# EAGLE board 10m02 (EAGLE 6.5.0)
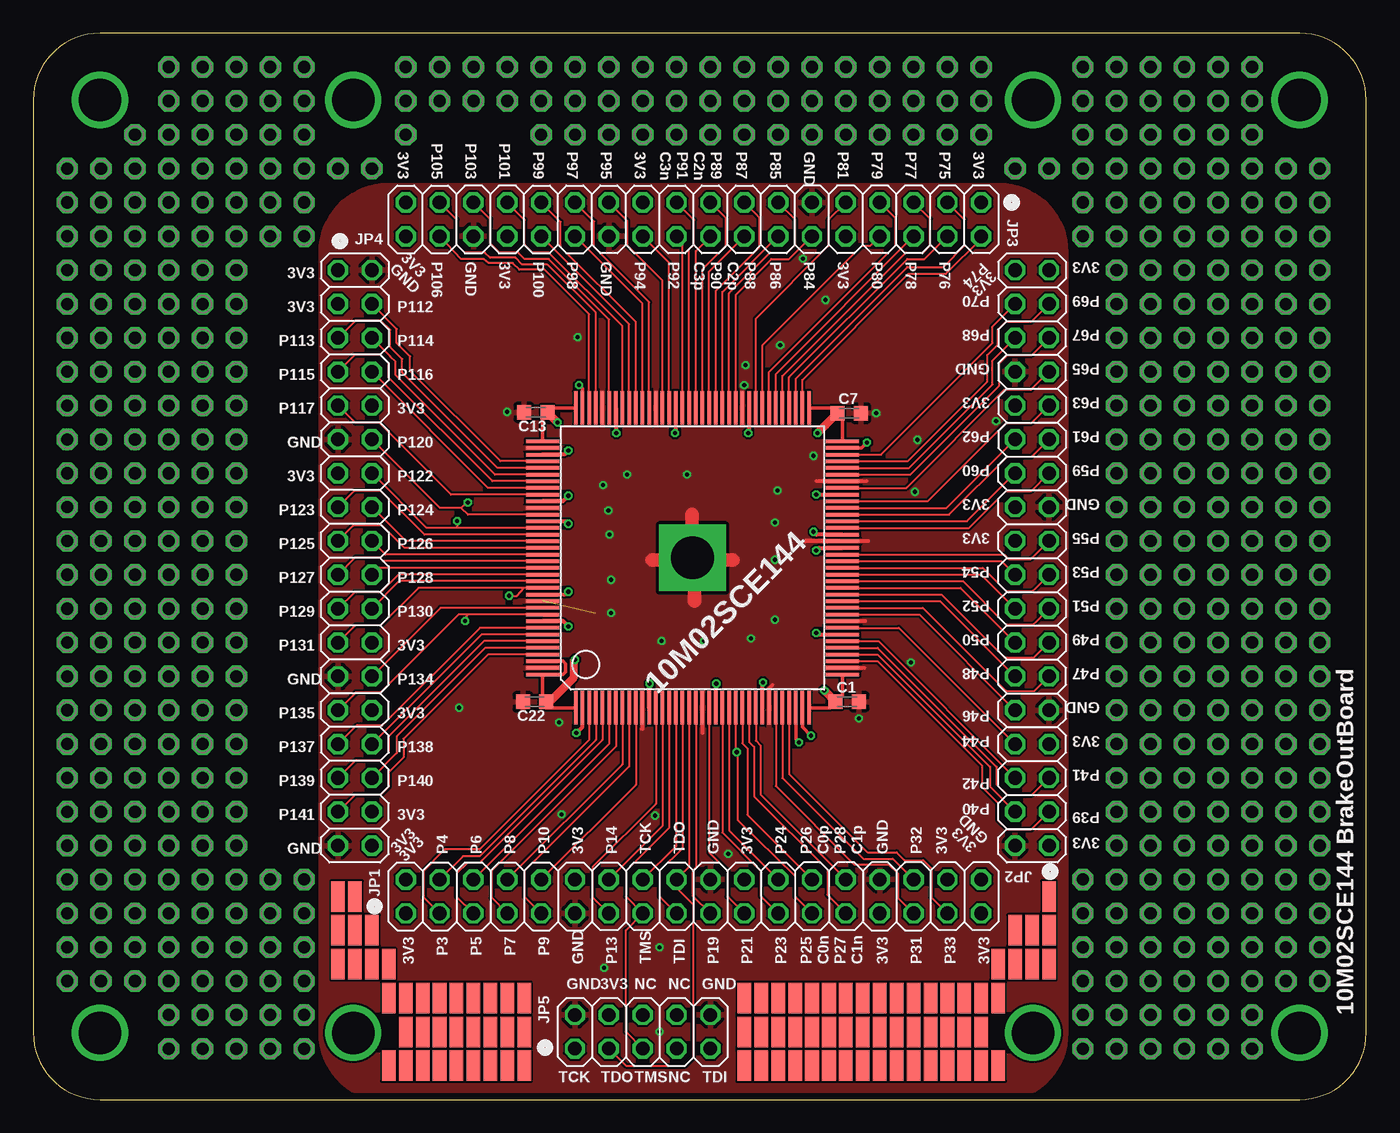
[diagram p1: board, top side]
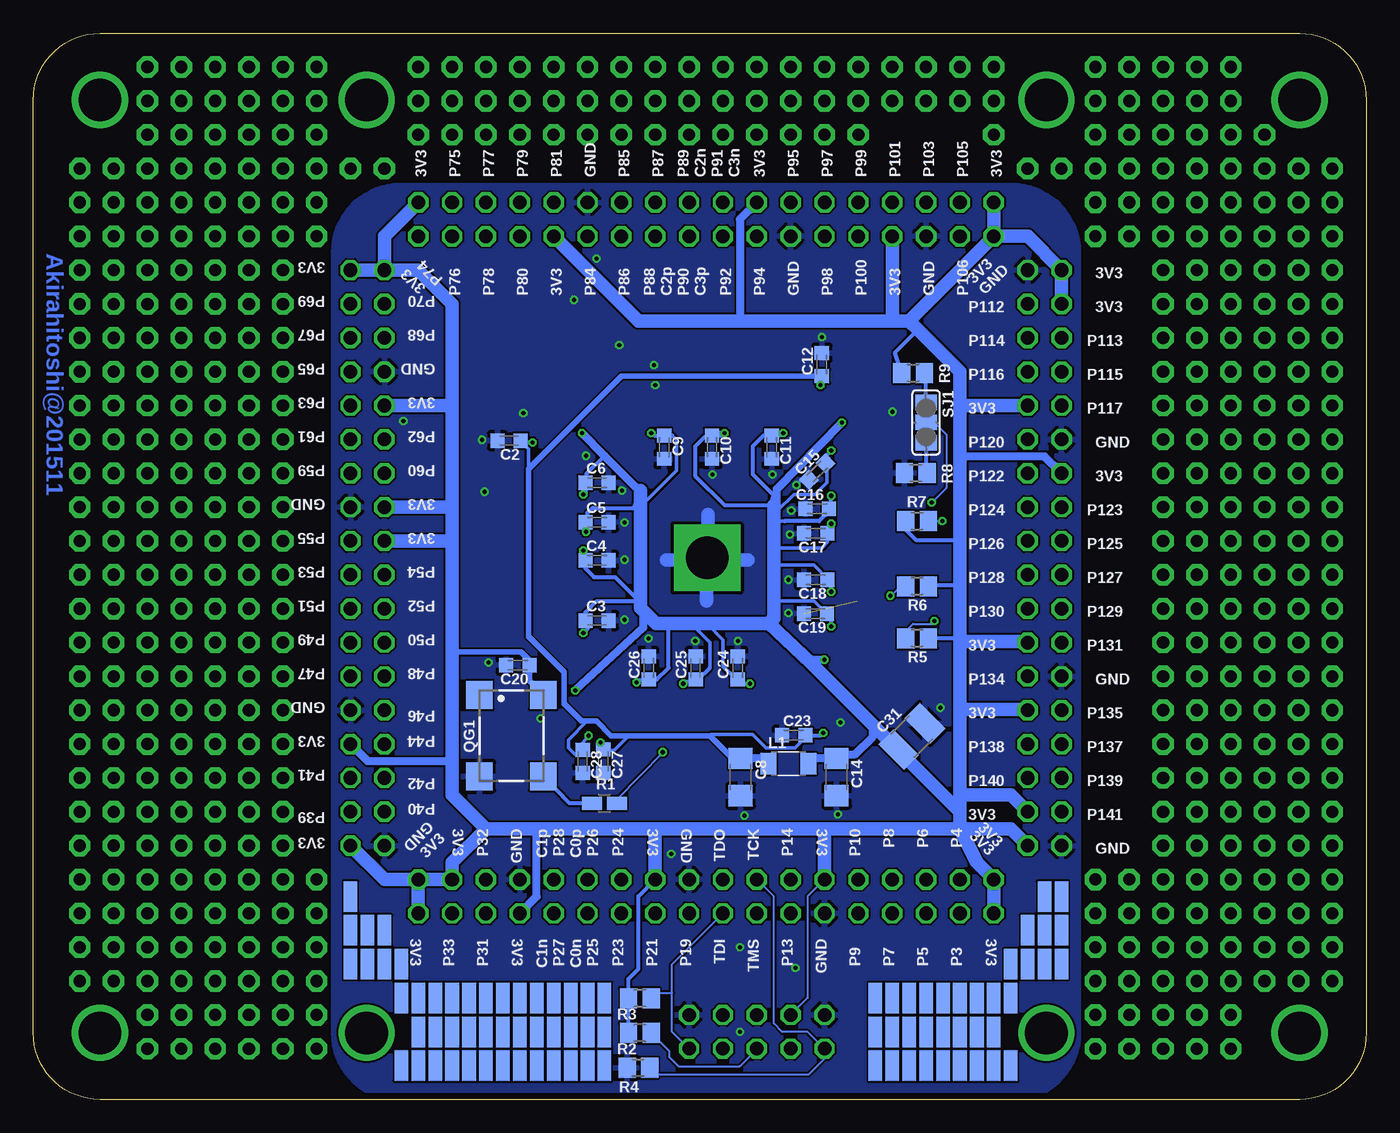
[diagram p2: board, bottom side, seen from below]

Size 100 x 80 mm. Coordinates in mm from the lower left corner, seen from the top.
Outline: 95,80 5,80 arc90 0,75 0,5 arc90 5,0 95,0 arc90 100,5 100,75 arc90 95,80
Copper layers (1*16): Top 0.035mm / dielectric 1.6mm / Bottom 0.035mm
Design rules "Elecrow_2-layer_PCB_eagle_rule": minimum track width 6mil, minimum drill 12mil, track to track 6mil, track to pad 6mil, pad to pad 6mil, via to via 8mil, smd to smd 0mil, copper to edge 20mil, drill to drill 10mil, minimum pad ring 6mil, minimum via ring 6mil, stop-mask expansion 0mil, vias tented up to drill 100mil, thermal gap 10mil

## Footprints (pad centres in the part's own frame; a part is rotated, then mirrored left to right if it is on the bottom)
C0603K = smd 1.05 x 1.08: 1 -0.875,0; 2 0.875,0
C3216 = smd 1.6 x 1.8: 1 -1.4,0; 2 1.4,0
C3225 = smd 1.6 x 2.7: 1 -1.4,0; 2 1.4,0
TQFP144G = smd 2.5 x 0.27: 1 -11.25,8.83; 2 -11.25,8.33; 3 -11.25,7.83; 4 -11.25,7.33; 5 -11.25,6.83; 6 -11.25,6.33; 7 -11.25,5.83; 8 -11.25,5.33; 9 -11.25,4.83; 10 -11.25,4.33; 11 -11.25,3.83; 12 -11.25,3.33; 13 -11.25,2.83; 14 -11.25,2.33; 15 -11.25,1.83; 16 -11.25,1.33; 17 -11.25,0.83; 18 -11.25,0.33; 19 -11.25,-0.17; 20 -11.25,-0.67; 21 -11.25,-1.17; 22 -11.25,-1.67; 23 -11.25,-2.17; 24 -11.25,-2.67; 25 -11.25,-3.17; 26 -11.25,-3.67; 27 -11.25,-4.17; 28 -11.25,-4.67; 29 -11.25,-5.17; 30 -11.25,-5.67; 31 -11.25,-6.17; 32 -11.25,-6.67; 33 -11.25,-7.17; 34 -11.25,-7.67; 35 -11.25,-8.17; 36 -11.25,-8.67; 73 11.25,-8.67; 74 11.25,-8.17; 75 11.25,-7.67; 76 11.25,-7.17; 77 11.25,-6.67; 78 11.25,-6.17; 79 11.25,-5.67; 80 11.25,-5.17; 81 11.25,-4.67; 82 11.25,-4.17; 83 11.25,-3.67; 84 11.25,-3.17; 85 11.25,-2.67; 86 11.25,-2.17; 87 11.25,-1.67; 88 11.25,-1.17; 89 11.25,-0.67; 90 11.25,-0.17; 91 11.25,0.33; 92 11.25,0.83; 93 11.25,1.33; 94 11.25,1.83; 95 11.25,2.33; 96 11.25,2.83; 97 11.25,3.33; 98 11.25,3.83; 99 11.25,4.33; 100 11.25,4.83; 101 11.25,5.33; 102 11.25,5.83; 103 11.25,6.33; 104 11.25,6.83; 105 11.25,7.33; 106 11.25,7.83; 107 11.25,8.33; 108 11.25,8.83 | smd 0.27 x 2.5: 37 -8.75,-11.17; 38 -8.25,-11.17; 39 -7.75,-11.17; 40 -7.25,-11.17; 41 -6.75,-11.17; 42 -6.25,-11.17; 43 -5.75,-11.17; 44 -5.25,-11.17; 45 -4.75,-11.17; 46 -4.25,-11.17; 47 -3.75,-11.17; 48 -3.25,-11.17; 49 -2.75,-11.17; 50 -2.25,-11.17; 51 -1.75,-11.17; 52 -1.25,-11.17; 53 -0.75,-11.17; 54 -0.25,-11.17; 55 0.25,-11.17; 56 0.75,-11.17; 57 1.25,-11.17; 58 1.75,-11.17; 59 2.25,-11.17; 60 2.75,-11.17; 61 3.25,-11.17; 62 3.75,-11.17; 63 4.25,-11.17; 64 4.75,-11.17; 65 5.25,-11.17; 66 5.75,-11.17; 67 6.25,-11.17; 68 6.75,-11.17; 69 7.25,-11.17; 70 7.75,-11.17; 71 8.25,-11.17; 72 8.75,-11.17; 109 8.75,11.33; 110 8.25,11.33; 111 7.75,11.33; 112 7.25,11.33; 113 6.75,11.33; 114 6.25,11.33; 115 5.75,11.33; 116 5.25,11.33; 117 4.75,11.33; 118 4.25,11.33; 119 3.75,11.33; 120 3.25,11.33; 121 2.75,11.33; 122 2.25,11.33; 123 1.75,11.33; 124 1.25,11.33; 125 0.75,11.33; 126 0.25,11.33; 127 -0.25,11.33; 128 -0.75,11.33; 129 -1.25,11.33; 130 -1.75,11.33; 131 -2.25,11.33; 132 -2.75,11.33; 133 -3.25,11.33; 134 -3.75,11.33; 135 -4.25,11.33; 136 -4.75,11.33; 137 -5.25,11.33; 138 -5.75,11.33; 139 -6.25,11.33; 140 -6.75,11.33; 141 -7.25,11.33; 142 -7.75,11.33; 143 -8.25,11.33; 144 -8.75,11.33 | drill 3.2 pad 5 square: 145 0,0.08
2X18 = drill 1.016 octagon: 1 -21.59,-1.27; 2 -21.59,1.27; 3 -19.05,-1.27; 4 -19.05,1.27; 5 -16.51,-1.27; 6 -16.51,1.27; 7 -13.97,-1.27; 8 -13.97,1.27; 9 -11.43,-1.27; 10 -11.43,1.27; 11 -8.89,-1.27; 12 -8.89,1.27; 13 -6.35,-1.27; 14 -6.35,1.27; 15 -3.81,-1.27; 16 -3.81,1.27; 17 -1.27,-1.27; 18 -1.27,1.27; 19 1.27,-1.27; 20 1.27,1.27; 21 3.81,-1.27; 22 3.81,1.27; 23 6.35,-1.27; 24 6.35,1.27; 25 8.89,-1.27; 26 8.89,1.27; 27 11.43,-1.27; 28 11.43,1.27; 29 13.97,-1.27; 30 13.97,1.27; 31 16.51,-1.27; 32 16.51,1.27; 33 19.05,-1.27; 34 19.05,1.27; 35 21.59,-1.27; 36 21.59,1.27
2X05 = drill 1.016 octagon: 1 -5.08,-1.27; 2 -5.08,1.27; 3 -2.54,-1.27; 4 -2.54,1.27; 5 0,-1.27; 6 0,1.27; 7 2.54,-1.27; 8 2.54,1.27; 9 5.08,-1.27; 10 5.08,1.27
L3216C = smd 1.2 x 1.6: 1 -1.5,0; 2 1.5,0
1,6/0,9 = drill 0.914 pad 1.6 octagon: 1 0,0
SMD1,27-2,54 = smd 1.02 x 2.29: 1 0,0
SM77HL = smd 2.1 x 2: 1 -3.05,-2.4; 2 3.05,-2.4; 3 3.05,2.4; 4 -3.05,2.4
R2012W = smd 1.5 x 1: 1 -0.94,0; 2 0.94,0
R2012 = smd 1.3 x 1.5: 1 -0.85,0; 2 0.85,0
SJ_2 = smd 1.168 x 1.6: 1 -1.524,0; 2 0,0; 3 1.524,0

## Placement (x,y rotation side)
C1  0.1u  [C0603K]  61.07,29.85 0 top
C2  0.1u  [C0603K]  64.31,49.44 180 bottom
C3  0.1u  [C0603K]  57.71,35.94 0 bottom
C4  0.1u  [C0603K]  57.71,40.46 0 bottom
C5  0.1u  [C0603K]  57.71,43.32 0 bottom
C6  0.1u  [C0603K]  57.71,46.28 0 bottom
C7  0.1u  [C0603K]  61.21,51.5 0 top
C8  [C3216]  46.94,24.2 270 bottom
C9  0.1u  [C0603K]  52.67,48.95 270 bottom
C10  0.1u  [C0603K]  49.08,48.95 270 bottom
C11  0.1u  [C0603K]  44.59,48.95 270 bottom
C12  0.1u  [C0603K]  40.84,55.15 90 bottom
C13  0.1u  [C0603K]  37.69,51.56 180 top
C14  [C3216]  39.74,24.2 270 bottom
C15  0.1u  [C0603K]  41.19,47.12 225 bottom
C16  0.1u  [C0603K]  41.19,44.32 180 bottom
C17  0.1u  [C0603K]  41.29,42.48 180 bottom
C18  0.1u  [C0603K]  41.29,39 180 bottom
C19  0.1u  [C0603K]  41.32,36.46 180 bottom
C20  0.1u  [C0603K]  63.66,32.59 180 bottom
C22  0.1u  [C0603K]  37.61,29.84 180 top
C23  0.1u  [C0603K]  42.94,27.33 0 bottom
C24  0.1u  [C0603K]  47.16,32.38 90 bottom
C25  0.1u  [C0603K]  50.31,32.38 90 bottom
C26  0.1u  [C0603K]  53.84,32.38 90 bottom
C27  0.1u  [C0603K]  57.23,25.38 270 bottom
C28  0.1u  [C0603K]  58.79,25.37 270 bottom
C31  [C3225]  34.1,27.23 45 bottom
IC1  10M02SC144  [TQFP144G]  49.53,40.64 90 top
JP1  [2X18]  49.53,15.24 0 top
JP2  [2X18]  74.93,40.64 90 top
JP3  [2X18]  49.53,66.04 180 top
JP4  [2X18]  24.13,40.64 270 top
JP5  [2X05]  45.72,5.08 0 top
L1  [L3216C]  43.34,25.2 0 bottom
PAD1  [1,6/0,9]  81.28,3.81 0 top
PAD2  [1,6/0,9]  10.16,3.81 0 top
PAD3  [1,6/0,9]  10.16,6.35 0 top
PAD4  [1,6/0,9]  20.32,8.89 0 top
PAD5  [1,6/0,9]  20.32,11.43 0 top
PAD6  [1,6/0,9]  20.32,13.97 0 top
PAD7  [1,6/0,9]  20.32,16.51 0 top
PAD8  [1,6/0,9]  17.78,16.51 0 top
PAD9  [1,6/0,9]  17.78,13.97 0 top
PAD10  [1,6/0,9]  5.08,69.85 0 top
PAD11  [1,6/0,9]  5.08,67.31 0 top
PAD12  [1,6/0,9]  2.54,69.85 90 top
PAD13  [1,6/0,9]  2.54,67.31 90 top
PAD14  [1,6/0,9]  2.54,64.77 90 top
PAD15  [1,6/0,9]  2.54,62.23 90 top
PAD16  [1,6/0,9]  2.54,59.69 90 top
PAD17  [1,6/0,9]  2.54,57.15 90 top
PAD18  [1,6/0,9]  2.54,54.61 90 top
PAD19  [1,6/0,9]  2.54,52.07 0 top
PAD20  [1,6/0,9]  15.24,19.05 0 top
PAD21  [1,6/0,9]  12.7,19.05 0 top
PAD22  [1,6/0,9]  10.16,19.05 0 top
PAD23  [1,6/0,9]  7.62,19.05 0 top
PAD24  [1,6/0,9]  5.08,19.05 0 top
PAD25  [1,6/0,9]  2.54,19.05 0 top
PAD26  [1,6/0,9]  17.78,11.43 0 top
PAD27  [1,6/0,9]  88.9,57.15 0 top
PAD28  [1,6/0,9]  86.36,57.15 0 top
PAD29  [1,6/0,9]  83.82,57.15 0 top
PAD30  [1,6/0,9]  81.28,57.15 0 top
PAD31  [1,6/0,9]  81.28,54.61 0 top
PAD32  [1,6/0,9]  83.82,54.61 0 top
PAD33  [1,6/0,9]  86.36,54.61 0 top
PAD34  [1,6/0,9]  88.9,54.61 0 top
PAD35  [1,6/0,9]  17.78,8.89 270 top
PAD36  [1,6/0,9]  81.28,52.07 0 top
PAD37  [1,6/0,9]  83.82,52.07 0 top
PAD38  [1,6/0,9]  86.36,52.07 0 top
PAD39  [1,6/0,9]  88.9,52.07 0 top
PAD40  [1,6/0,9]  15.24,8.89 270 top
PAD41  [1,6/0,9]  81.28,49.53 0 top
PAD42  [1,6/0,9]  83.82,49.53 0 top
PAD43  [1,6/0,9]  86.36,49.53 0 top
PAD44  [1,6/0,9]  88.9,49.53 0 top
PAD45  [1,6/0,9]  12.7,8.89 270 top
PAD46  [1,6/0,9]  81.28,46.99 0 top
PAD47  [1,6/0,9]  83.82,46.99 0 top
PAD48  [1,6/0,9]  86.36,46.99 0 top
PAD49  [1,6/0,9]  88.9,46.99 0 top
PAD50  [1,6/0,9]  10.16,8.89 270 top
PAD51  [1,6/0,9]  81.28,44.45 0 top
PAD52  [1,6/0,9]  83.82,44.45 0 top
PAD53  [1,6/0,9]  86.36,44.45 0 top
PAD54  [1,6/0,9]  88.9,44.45 0 top
PAD55  [1,6/0,9]  7.62,8.89 270 top
PAD56  [1,6/0,9]  81.28,41.91 0 top
PAD57  [1,6/0,9]  83.82,41.91 0 top
PAD58  [1,6/0,9]  86.36,41.91 0 top
PAD59  [1,6/0,9]  88.9,41.91 0 top
PAD60  [1,6/0,9]  5.08,8.89 270 top
PAD61  [1,6/0,9]  81.28,39.37 0 top
PAD62  [1,6/0,9]  83.82,39.37 0 top
PAD63  [1,6/0,9]  86.36,39.37 0 top
PAD64  [1,6/0,9]  88.9,39.37 0 top
PAD65  [1,6/0,9]  2.54,8.89 270 top
PAD66  [1,6/0,9]  12.7,6.35 0 top
PAD67  [1,6/0,9]  15.24,6.35 0 top
PAD68  [1,6/0,9]  81.28,36.83 0 top
PAD69  [1,6/0,9]  83.82,36.83 0 top
PAD70  [1,6/0,9]  86.36,36.83 0 top
PAD71  [1,6/0,9]  88.9,36.83 0 top
PAD72  [1,6/0,9]  12.7,3.81 0 top
PAD73  [1,6/0,9]  83.82,3.81 0 top
PAD74  [1,6/0,9]  15.24,3.81 0 top
PAD75  [1,6/0,9]  81.28,34.29 0 top
PAD76  [1,6/0,9]  83.82,34.29 0 top
PAD77  [1,6/0,9]  86.36,34.29 0 top
PAD78  [1,6/0,9]  88.9,34.29 0 top
PAD79  [1,6/0,9]  15.24,16.51 270 top
PAD80  [1,6/0,9]  15.24,13.97 270 top
PAD81  [1,6/0,9]  15.24,11.43 270 top
PAD82  [1,6/0,9]  81.28,31.75 0 top
PAD83  [1,6/0,9]  83.82,31.75 0 top
PAD84  [1,6/0,9]  86.36,31.75 0 top
PAD85  [1,6/0,9]  88.9,31.75 0 top
PAD86  [1,6/0,9]  12.7,16.51 270 top
PAD87  [1,6/0,9]  12.7,13.97 270 top
PAD88  [1,6/0,9]  12.7,11.43 270 top
PAD89  [1,6/0,9]  81.28,29.21 0 top
PAD90  [1,6/0,9]  83.82,29.21 0 top
PAD91  [1,6/0,9]  86.36,29.21 0 top
PAD92  [1,6/0,9]  88.9,29.21 0 top
PAD93  [1,6/0,9]  10.16,16.51 270 top
PAD94  [1,6/0,9]  10.16,13.97 270 top
PAD95  [1,6/0,9]  10.16,11.43 270 top
PAD96  [1,6/0,9]  81.28,26.67 0 top
PAD97  [1,6/0,9]  83.82,26.67 0 top
PAD98  [1,6/0,9]  86.36,26.67 0 top
PAD99  [1,6/0,9]  88.9,26.67 0 top
PAD100  [1,6/0,9]  7.62,16.51 270 top
PAD101  [1,6/0,9]  7.62,13.97 270 top
PAD102  [1,6/0,9]  7.62,11.43 270 top
PAD103  [1,6/0,9]  81.28,24.13 0 top
PAD104  [1,6/0,9]  83.82,24.13 0 top
PAD105  [1,6/0,9]  86.36,24.13 0 top
PAD106  [1,6/0,9]  88.9,24.13 0 top
PAD107  [1,6/0,9]  5.08,16.51 270 top
PAD108  [1,6/0,9]  5.08,13.97 270 top
PAD109  [1,6/0,9]  5.08,11.43 270 top
PAD110  [1,6/0,9]  81.28,21.59 0 top
PAD111  [1,6/0,9]  83.82,21.59 0 top
PAD112  [1,6/0,9]  86.36,21.59 0 top
PAD113  [1,6/0,9]  88.9,21.59 0 top
PAD114  [1,6/0,9]  2.54,16.51 270 top
PAD115  [1,6/0,9]  2.54,13.97 270 top
PAD116  [1,6/0,9]  2.54,11.43 270 top
PAD117  [1,6/0,9]  81.28,19.05 0 top
PAD118  [1,6/0,9]  83.82,19.05 0 top
PAD119  [1,6/0,9]  86.36,19.05 0 top
PAD120  [1,6/0,9]  88.9,19.05 0 top
PAD121  [1,6/0,9]  2.54,49.53 0 top
PAD122  [1,6/0,9]  5.08,49.53 0 top
PAD123  [1,6/0,9]  7.62,49.53 0 top
PAD124  [1,6/0,9]  10.16,49.53 0 top
PAD125  [1,6/0,9]  12.7,49.53 0 top
PAD126  [1,6/0,9]  15.24,49.53 0 top
PAD127  [1,6/0,9]  5.08,52.07 0 top
PAD128  [1,6/0,9]  5.08,54.61 0 top
PAD129  [1,6/0,9]  5.08,57.15 0 top
PAD130  [1,6/0,9]  5.08,59.69 0 top
PAD131  [1,6/0,9]  2.54,46.99 0 top
PAD132  [1,6/0,9]  5.08,46.99 0 top
PAD133  [1,6/0,9]  7.62,46.99 0 top
PAD134  [1,6/0,9]  10.16,46.99 0 top
PAD135  [1,6/0,9]  12.7,46.99 0 top
PAD136  [1,6/0,9]  15.24,46.99 0 top
PAD137  [1,6/0,9]  5.08,62.23 0 top
PAD138  [1,6/0,9]  10.16,77.47 0 top
PAD139  [1,6/0,9]  12.7,77.47 0 top
PAD140  [1,6/0,9]  15.24,77.47 0 top
PAD141  [1,6/0,9]  2.54,44.45 0 top
PAD142  [1,6/0,9]  5.08,44.45 0 top
PAD143  [1,6/0,9]  7.62,44.45 0 top
PAD144  [1,6/0,9]  10.16,44.45 0 top
PAD145  [1,6/0,9]  12.7,44.45 0 top
PAD146  [1,6/0,9]  15.24,44.45 0 top
PAD147  [1,6/0,9]  5.08,64.77 0 top
PAD148  [1,6/0,9]  10.16,74.93 0 top
PAD149  [1,6/0,9]  12.7,74.93 0 top
PAD150  [1,6/0,9]  15.24,74.93 0 top
PAD151  [1,6/0,9]  2.54,41.91 0 top
PAD152  [1,6/0,9]  5.08,41.91 0 top
PAD153  [1,6/0,9]  7.62,41.91 0 top
PAD154  [1,6/0,9]  10.16,41.91 0 top
PAD155  [1,6/0,9]  12.7,41.91 0 top
PAD156  [1,6/0,9]  15.24,41.91 0 top
PAD157  [1,6/0,9]  7.62,72.39 0 top
PAD158  [1,6/0,9]  10.16,72.39 0 top
PAD159  [1,6/0,9]  12.7,72.39 0 top
PAD160  [1,6/0,9]  15.24,72.39 0 top
PAD161  [1,6/0,9]  2.54,39.37 0 top
PAD162  [1,6/0,9]  5.08,39.37 0 top
PAD163  [1,6/0,9]  7.62,39.37 0 top
PAD164  [1,6/0,9]  10.16,39.37 0 top
PAD165  [1,6/0,9]  12.7,39.37 0 top
PAD166  [1,6/0,9]  15.24,39.37 0 top
PAD167  [1,6/0,9]  7.62,69.85 0 top
PAD168  [1,6/0,9]  10.16,69.85 0 top
PAD169  [1,6/0,9]  12.7,69.85 0 top
PAD170  [1,6/0,9]  15.24,69.85 0 top
PAD171  [1,6/0,9]  2.54,36.83 0 top
PAD172  [1,6/0,9]  5.08,36.83 0 top
PAD173  [1,6/0,9]  7.62,36.83 0 top
PAD174  [1,6/0,9]  10.16,36.83 0 top
PAD175  [1,6/0,9]  12.7,36.83 0 top
PAD176  [1,6/0,9]  15.24,36.83 0 top
PAD177  [1,6/0,9]  7.62,67.31 0 top
PAD178  [1,6/0,9]  10.16,67.31 0 top
PAD179  [1,6/0,9]  12.7,67.31 0 top
PAD180  [1,6/0,9]  15.24,67.31 0 top
PAD181  [1,6/0,9]  2.54,34.29 0 top
PAD182  [1,6/0,9]  5.08,34.29 0 top
PAD183  [1,6/0,9]  7.62,34.29 0 top
PAD184  [1,6/0,9]  10.16,34.29 0 top
PAD185  [1,6/0,9]  12.7,34.29 0 top
PAD186  [1,6/0,9]  15.24,34.29 0 top
PAD187  [1,6/0,9]  7.62,64.77 0 top
PAD188  [1,6/0,9]  10.16,64.77 0 top
PAD189  [1,6/0,9]  12.7,64.77 0 top
PAD190  [1,6/0,9]  15.24,64.77 0 top
PAD191  [1,6/0,9]  2.54,31.75 0 top
PAD192  [1,6/0,9]  5.08,31.75 0 top
PAD193  [1,6/0,9]  7.62,31.75 0 top
PAD194  [1,6/0,9]  10.16,31.75 0 top
PAD195  [1,6/0,9]  12.7,31.75 0 top
PAD196  [1,6/0,9]  15.24,31.75 0 top
PAD197  [1,6/0,9]  7.62,62.23 0 top
PAD198  [1,6/0,9]  10.16,62.23 0 top
PAD199  [1,6/0,9]  12.7,62.23 0 top
PAD200  [1,6/0,9]  15.24,62.23 0 top
PAD201  [1,6/0,9]  2.54,29.21 0 top
PAD202  [1,6/0,9]  5.08,29.21 0 top
PAD203  [1,6/0,9]  7.62,29.21 0 top
PAD204  [1,6/0,9]  10.16,29.21 0 top
PAD205  [1,6/0,9]  12.7,29.21 0 top
PAD206  [1,6/0,9]  15.24,29.21 0 top
PAD207  [1,6/0,9]  7.62,59.69 0 top
PAD208  [1,6/0,9]  10.16,59.69 0 top
PAD209  [1,6/0,9]  12.7,59.69 0 top
PAD210  [1,6/0,9]  15.24,59.69 0 top
PAD211  [1,6/0,9]  2.54,26.67 0 top
PAD212  [1,6/0,9]  5.08,26.67 0 top
PAD213  [1,6/0,9]  7.62,26.67 0 top
PAD214  [1,6/0,9]  10.16,26.67 0 top
PAD215  [1,6/0,9]  12.7,26.67 0 top
PAD216  [1,6/0,9]  15.24,26.67 0 top
PAD217  [1,6/0,9]  7.62,57.15 0 top
PAD218  [1,6/0,9]  10.16,57.15 0 top
PAD219  [1,6/0,9]  12.7,57.15 0 top
PAD220  [1,6/0,9]  15.24,57.15 0 top
PAD221  [1,6/0,9]  2.54,24.13 0 top
PAD222  [1,6/0,9]  5.08,24.13 0 top
PAD223  [1,6/0,9]  7.62,24.13 0 top
PAD224  [1,6/0,9]  10.16,24.13 0 top
PAD225  [1,6/0,9]  12.7,24.13 0 top
PAD226  [1,6/0,9]  15.24,24.13 0 top
PAD227  [1,6/0,9]  7.62,54.61 0 top
PAD228  [1,6/0,9]  10.16,54.61 0 top
PAD229  [1,6/0,9]  12.7,54.61 0 top
PAD230  [1,6/0,9]  15.24,54.61 0 top
PAD231  [1,6/0,9]  2.54,21.59 0 top
PAD232  [1,6/0,9]  5.08,21.59 0 top
PAD233  [1,6/0,9]  7.62,21.59 0 top
PAD234  [1,6/0,9]  10.16,21.59 0 top
PAD235  [1,6/0,9]  12.7,21.59 0 top
PAD236  [1,6/0,9]  15.24,21.59 0 top
PAD237  [1,6/0,9]  7.62,52.07 0 top
PAD238  [1,6/0,9]  10.16,52.07 0 top
PAD239  [1,6/0,9]  12.7,52.07 0 top
PAD240  [1,6/0,9]  15.24,52.07 0 top
PAD241  [1,6/0,9]  81.28,13.97 0 top
PAD242  [1,6/0,9]  83.82,13.97 0 top
PAD243  [1,6/0,9]  86.36,13.97 0 top
PAD244  [1,6/0,9]  88.9,13.97 0 top
PAD245  [1,6/0,9]  91.44,13.97 0 top
PAD246  [1,6/0,9]  93.98,13.97 0 top
PAD247  [1,6/0,9]  96.52,13.97 0 top
PAD248  [1,6/0,9]  86.36,3.81 0 top
PAD249  [1,6/0,9]  17.78,3.81 0 top
PAD250  [1,6/0,9]  20.32,3.81 0 top
PAD251  [1,6/0,9]  88.9,3.81 0 top
PAD252  [1,6/0,9]  91.44,57.15 0 top
PAD253  [1,6/0,9]  93.98,57.15 0 top
PAD254  [1,6/0,9]  96.52,57.15 0 top
PAD255  [1,6/0,9]  81.28,11.43 0 top
PAD256  [1,6/0,9]  83.82,11.43 0 top
PAD257  [1,6/0,9]  86.36,11.43 0 top
PAD258  [1,6/0,9]  88.9,11.43 0 top
PAD259  [1,6/0,9]  91.44,11.43 0 top
PAD260  [1,6/0,9]  93.98,11.43 0 top
PAD261  [1,6/0,9]  96.52,11.43 0 top
PAD262  [1,6/0,9]  91.44,3.81 0 top
PAD263  [SMD1,27-2,54]  62.23,7.62 0 bottom
PAD264  [1,6/0,9]  35.56,74.93 90 top
PAD265  [1,6/0,9]  35.56,77.47 90 top
PAD266  [1,6/0,9]  91.44,54.61 0 top
PAD267  [1,6/0,9]  93.98,54.61 0 top
PAD268  [1,6/0,9]  96.52,54.61 0 top
PAD269  [1,6/0,9]  81.28,8.89 0 top
PAD270  [1,6/0,9]  83.82,8.89 0 top
PAD271  [1,6/0,9]  86.36,8.89 0 top
PAD272  [1,6/0,9]  88.9,8.89 0 top
PAD273  [1,6/0,9]  91.44,8.89 0 top
PAD274  [1,6/0,9]  93.98,8.89 0 top
PAD275  [1,6/0,9]  96.52,8.89 0 top
PAD276  [1,6/0,9]  78.74,13.97 0 top
PAD277  [1,6/0,9]  38.1,72.39 90 top
PAD278  [1,6/0,9]  38.1,74.93 90 top
PAD279  [1,6/0,9]  38.1,77.47 90 top
PAD280  [1,6/0,9]  91.44,52.07 0 top
PAD281  [1,6/0,9]  93.98,52.07 0 top
PAD282  [1,6/0,9]  96.52,52.07 0 top
PAD283  [1,6/0,9]  81.28,6.35 0 top
PAD284  [1,6/0,9]  83.82,6.35 0 top
PAD285  [1,6/0,9]  86.36,6.35 0 top
PAD286  [1,6/0,9]  88.9,6.35 0 top
PAD287  [1,6/0,9]  91.44,6.35 0 top
PAD288  [1,6/0,9]  17.78,6.35 0 top
PAD289  [1,6/0,9]  20.32,6.35 0 top
PAD290  [1,6/0,9]  78.74,11.43 0 top
PAD291  [1,6/0,9]  40.64,72.39 90 top
PAD292  [1,6/0,9]  40.64,74.93 90 top
PAD293  [1,6/0,9]  40.64,77.47 90 top
PAD294  [1,6/0,9]  91.44,49.53 0 top
PAD295  [1,6/0,9]  93.98,49.53 0 top
PAD296  [1,6/0,9]  96.52,49.53 0 top
PAD297  [1,6/0,9]  81.28,72.39 0 top
PAD298  [1,6/0,9]  83.82,72.39 0 top
PAD299  [1,6/0,9]  86.36,72.39 0 top
PAD300  [1,6/0,9]  88.9,72.39 0 top
PAD301  [1,6/0,9]  91.44,72.39 0 top
PAD302  [1,6/0,9]  81.28,74.93 0 top
PAD303  [1,6/0,9]  81.28,77.47 0 top
PAD304  [1,6/0,9]  78.74,8.89 0 top
PAD305  [1,6/0,9]  43.18,72.39 90 top
PAD306  [1,6/0,9]  43.18,74.93 90 top
PAD307  [1,6/0,9]  43.18,77.47 90 top
PAD308  [1,6/0,9]  91.44,46.99 0 top
PAD309  [1,6/0,9]  93.98,46.99 0 top
PAD310  [1,6/0,9]  96.52,46.99 0 top
PAD311  [1,6/0,9]  81.28,69.85 0 top
PAD312  [1,6/0,9]  83.82,69.85 0 top
PAD313  [1,6/0,9]  86.36,69.85 0 top
PAD314  [1,6/0,9]  88.9,69.85 0 top
PAD315  [1,6/0,9]  91.44,69.85 0 top
PAD316  [1,6/0,9]  93.98,69.85 0 top
PAD317  [1,6/0,9]  96.52,69.85 0 top
PAD318  [1,6/0,9]  78.74,6.35 0 top
PAD319  [1,6/0,9]  45.72,72.39 90 top
PAD320  [1,6/0,9]  45.72,74.93 90 top
PAD321  [1,6/0,9]  45.72,77.47 90 top
PAD322  [1,6/0,9]  91.44,44.45 0 top
PAD323  [1,6/0,9]  93.98,44.45 0 top
PAD324  [1,6/0,9]  96.52,44.45 0 top
PAD325  [1,6/0,9]  81.28,67.31 0 top
PAD326  [1,6/0,9]  83.82,67.31 0 top
PAD327  [1,6/0,9]  86.36,67.31 0 top
PAD328  [1,6/0,9]  88.9,67.31 0 top
PAD329  [1,6/0,9]  91.44,67.31 0 top
PAD330  [1,6/0,9]  93.98,67.31 0 top
PAD331  [1,6/0,9]  96.52,67.31 0 top
PAD332  [1,6/0,9]  78.74,3.81 0 top
PAD333  [1,6/0,9]  48.26,72.39 90 top
PAD334  [1,6/0,9]  48.26,74.93 90 top
PAD335  [1,6/0,9]  48.26,77.47 90 top
PAD336  [1,6/0,9]  91.44,41.91 0 top
PAD337  [1,6/0,9]  93.98,41.91 0 top
PAD338  [1,6/0,9]  96.52,41.91 0 top
PAD339  [1,6/0,9]  81.28,64.77 0 top
PAD340  [1,6/0,9]  83.82,64.77 0 top
PAD341  [1,6/0,9]  86.36,64.77 0 top
PAD342  [1,6/0,9]  88.9,64.77 0 top
PAD343  [1,6/0,9]  91.44,64.77 0 top
PAD344  [1,6/0,9]  93.98,64.77 0 top
PAD345  [1,6/0,9]  96.52,64.77 0 top
PAD346  [1,6/0,9]  76.2,69.85 0 top
PAD347  [1,6/0,9]  50.8,72.39 90 top
PAD348  [1,6/0,9]  50.8,74.93 90 top
PAD349  [1,6/0,9]  50.8,77.47 90 top
PAD350  [1,6/0,9]  91.44,39.37 0 top
PAD351  [1,6/0,9]  93.98,39.37 0 top
PAD352  [1,6/0,9]  96.52,39.37 0 top
PAD353  [1,6/0,9]  81.28,62.23 0 top
PAD354  [1,6/0,9]  83.82,62.23 0 top
PAD355  [1,6/0,9]  86.36,62.23 0 top
PAD356  [1,6/0,9]  88.9,62.23 0 top
PAD357  [1,6/0,9]  91.44,62.23 0 top
PAD358  [1,6/0,9]  93.98,62.23 0 top
PAD359  [1,6/0,9]  96.52,62.23 0 top
PAD360  [1,6/0,9]  73.66,69.85 0 top
PAD361  [1,6/0,9]  53.34,72.39 90 top
PAD362  [1,6/0,9]  53.34,74.93 90 top
PAD363  [1,6/0,9]  53.34,77.47 90 top
PAD364  [1,6/0,9]  91.44,36.83 0 top
PAD365  [1,6/0,9]  93.98,36.83 0 top
PAD366  [1,6/0,9]  96.52,36.83 0 top
PAD367  [1,6/0,9]  81.28,59.69 0 top
PAD368  [1,6/0,9]  83.82,59.69 0 top
PAD369  [1,6/0,9]  86.36,59.69 0 top
PAD370  [1,6/0,9]  88.9,59.69 0 top
PAD371  [1,6/0,9]  91.44,59.69 0 top
PAD372  [1,6/0,9]  93.98,59.69 0 top
PAD373  [1,6/0,9]  96.52,59.69 0 top
PAD374  [1,6/0,9]  27.94,72.39 0 top
PAD375  [1,6/0,9]  55.88,72.39 90 top
PAD376  [1,6/0,9]  55.88,74.93 90 top
PAD377  [1,6/0,9]  55.88,77.47 90 top
PAD378  [1,6/0,9]  91.44,34.29 0 top
PAD379  [1,6/0,9]  93.98,34.29 0 top
PAD380  [1,6/0,9]  96.52,34.29 0 top
PAD381  [1,6/0,9]  83.82,77.47 0 top
PAD382  [1,6/0,9]  86.36,77.47 0 top
PAD383  [1,6/0,9]  88.9,77.47 0 top
PAD384  [1,6/0,9]  91.44,77.47 0 top
PAD385  [SMD1,27-2,54]  59.69,7.62 0 bottom
PAD386  [SMD1,27-2,54]  57.15,7.62 0 bottom
PAD387  [SMD1,27-2,54]  71.12,7.62 0 bottom
PAD388  [SMD1,27-2,54]  68.58,7.62 0 bottom
PAD389  [1,6/0,9]  58.42,72.39 90 top
PAD390  [1,6/0,9]  58.42,74.93 90 top
PAD391  [1,6/0,9]  58.42,77.47 90 top
PAD392  [1,6/0,9]  91.44,31.75 0 top
PAD393  [1,6/0,9]  93.98,31.75 0 top
PAD394  [1,6/0,9]  96.52,31.75 0 top
PAD395  [1,6/0,9]  83.82,74.93 0 top
PAD396  [1,6/0,9]  86.36,74.93 0 top
PAD397  [1,6/0,9]  88.9,74.93 0 top
PAD398  [1,6/0,9]  91.44,74.93 0 top
PAD399  [SMD1,27-2,54]  66.04,7.62 0 bottom
PAD400  [SMD1,27-2,54]  63.5,7.62 0 bottom
PAD401  [SMD1,27-2,54]  60.96,7.62 0 bottom
PAD402  [SMD1,27-2,54]  58.42,7.62 0 bottom
PAD403  [1,6/0,9]  60.96,72.39 90 top
PAD404  [1,6/0,9]  60.96,74.93 90 top
PAD405  [1,6/0,9]  60.96,77.47 90 top
PAD406  [1,6/0,9]  91.44,29.21 0 top
PAD407  [1,6/0,9]  93.98,29.21 0 top
PAD408  [1,6/0,9]  96.52,29.21 0 top
PAD409  [1,6/0,9]  78.74,77.47 0 top
PAD410  [1,6/0,9]  27.94,77.47 0 top
PAD411  [1,6/0,9]  30.48,77.47 0 top
PAD412  [1,6/0,9]  33.02,77.47 0 top
PAD413  [SMD1,27-2,54]  54.61,5.08 0 top
PAD414  [SMD1,27-2,54]  67.31,7.62 0 bottom
PAD415  [SMD1,27-2,54]  69.85,7.62 0 bottom
PAD416  [SMD1,27-2,54]  72.39,7.62 0 bottom
PAD417  [1,6/0,9]  63.5,72.39 90 top
PAD418  [1,6/0,9]  63.5,74.93 90 top
PAD419  [1,6/0,9]  63.5,77.47 90 top
PAD420  [1,6/0,9]  91.44,26.67 0 top
PAD421  [1,6/0,9]  93.98,26.67 0 top
PAD422  [1,6/0,9]  96.52,26.67 0 top
PAD423  [1,6/0,9]  78.74,74.93 0 top
PAD424  [1,6/0,9]  27.94,74.93 0 top
PAD425  [1,6/0,9]  30.48,74.93 0 top
PAD426  [1,6/0,9]  33.02,74.93 0 top
PAD427  [SMD1,27-2,54]  67.31,5.08 0 bottom
PAD428  [SMD1,27-2,54]  69.85,5.08 0 bottom
PAD429  [SMD1,27-2,54]  57.15,5.08 0 bottom
PAD430  [SMD1,27-2,54]  67.31,2.54 0 bottom
PAD431  [1,6/0,9]  66.04,72.39 90 top
PAD432  [1,6/0,9]  66.04,74.93 90 top
PAD433  [1,6/0,9]  66.04,77.47 90 top
PAD434  [1,6/0,9]  91.44,24.13 0 top
PAD435  [1,6/0,9]  93.98,24.13 0 top
PAD436  [1,6/0,9]  96.52,24.13 0 top
PAD437  [1,6/0,9]  78.74,72.39 0 top
PAD438  [1,6/0,9]  22.86,69.85 0 top
PAD439  [1,6/0,9]  25.4,69.85 0 top
PAD440  [SMD1,27-2,54]  69.85,2.54 0 bottom
PAD441  [SMD1,27-2,54]  72.39,2.54 0 bottom
PAD442  [SMD1,27-2,54]  64.77,7.62 0 bottom
PAD443  [SMD1,27-2,54]  26.67,7.62 0 bottom
PAD444  [SMD1,27-2,54]  29.21,7.62 0 bottom
PAD445  [1,6/0,9]  68.58,72.39 90 top
PAD446  [1,6/0,9]  68.58,74.93 90 top
PAD447  [1,6/0,9]  68.58,77.47 90 top
PAD448  [1,6/0,9]  91.44,21.59 0 top
PAD449  [1,6/0,9]  93.98,21.59 0 top
PAD450  [1,6/0,9]  96.52,21.59 0 top
PAD451  [1,6/0,9]  78.74,69.85 0 top
PAD452  [1,6/0,9]  17.78,69.85 90 top
PAD453  [1,6/0,9]  17.78,72.39 90 top
PAD454  [1,6/0,9]  17.78,74.93 90 top
PAD455  [1,6/0,9]  17.78,77.47 90 top
PAD456  [1,6/0,9]  17.78,67.31 0 top
PAD457  [1,6/0,9]  20.32,67.31 0 top
PAD458  [SMD1,27-2,54]  31.75,7.62 0 bottom
PAD459  [1,6/0,9]  71.12,72.39 90 top
PAD460  [1,6/0,9]  71.12,74.93 90 top
PAD461  [1,6/0,9]  71.12,77.47 90 top
PAD462  [1,6/0,9]  91.44,19.05 0 top
PAD463  [1,6/0,9]  93.98,19.05 0 top
PAD464  [1,6/0,9]  96.52,19.05 0 top
PAD465  [1,6/0,9]  78.74,67.31 0 top
PAD466  [1,6/0,9]  20.32,69.85 90 top
PAD467  [1,6/0,9]  20.32,72.39 90 top
PAD468  [1,6/0,9]  20.32,74.93 90 top
PAD469  [1,6/0,9]  20.32,77.47 90 top
PAD470  [1,6/0,9]  17.78,64.77 0 top
PAD471  [1,6/0,9]  20.32,64.77 0 top
PAD472  [1,6/0,9]  81.28,16.51 0 top
PAD473  [1,6/0,9]  83.82,16.51 0 top
PAD474  [1,6/0,9]  86.36,16.51 0 top
PAD475  [1,6/0,9]  88.9,16.51 0 top
PAD476  [1,6/0,9]  91.44,16.51 0 top
PAD477  [1,6/0,9]  93.98,16.51 0 top
PAD478  [1,6/0,9]  96.52,16.51 0 top
PAD479  [1,6/0,9]  78.74,64.77 0 top
PAD480  [1,6/0,9]  78.74,16.51 0 top
PAD481  [SMD1,27-2,54]  34.29,7.62 0 bottom
PAD482  [SMD1,27-2,54]  74.93,10.16 0 bottom
PAD483  [SMD1,27-2,54]  29.21,5.08 0 bottom
PAD484  [SMD1,27-2,54]  31.75,5.08 0 bottom
PAD485  [SMD1,27-2,54]  34.29,5.08 0 bottom
PAD486  [SMD1,27-2,54]  26.67,2.54 0 bottom
PAD487  [SMD1,27-2,54]  29.21,2.54 0 bottom
PAD488  [SMD1,27-2,54]  31.75,2.54 0 bottom
PAD489  [SMD1,27-2,54]  34.29,2.54 0 bottom
PAD490  [SMD1,27-2,54]  27.94,7.62 0 bottom
PAD491  [SMD1,27-2,54]  30.48,7.62 0 bottom
PAD492  [SMD1,27-2,54]  33.02,7.62 0 bottom
PAD493  [SMD1,27-2,54]  35.56,7.62 0 bottom
PAD494  [SMD1,27-2,54]  27.94,5.08 0 bottom
PAD495  [SMD1,27-2,54]  30.48,5.08 0 bottom
PAD496  [SMD1,27-2,54]  33.02,5.08 0 bottom
PAD497  [SMD1,27-2,54]  35.56,5.08 0 bottom
PAD498  [SMD1,27-2,54]  27.94,2.54 0 bottom
PAD499  [SMD1,27-2,54]  30.48,2.54 0 bottom
PAD500  [SMD1,27-2,54]  33.02,2.54 0 bottom
PAD501  [SMD1,27-2,54]  35.56,2.54 0 bottom
PAD502  [SMD1,27-2,54]  36.83,7.62 0 bottom
PAD503  [SMD1,27-2,54]  66.04,5.08 0 bottom
PAD504  [SMD1,27-2,54]  68.58,5.08 0 bottom
PAD505  [SMD1,27-2,54]  71.12,5.08 0 bottom
PAD506  [SMD1,27-2,54]  36.83,5.08 0 bottom
PAD507  [SMD1,27-2,54]  66.04,2.54 0 bottom
PAD508  [SMD1,27-2,54]  68.58,2.54 0 bottom
PAD509  [SMD1,27-2,54]  71.12,2.54 0 bottom
PAD510  [SMD1,27-2,54]  36.83,2.54 0 bottom
PAD511  [SMD1,27-2,54]  59.69,5.08 0 bottom
PAD512  [SMD1,27-2,54]  62.23,5.08 0 bottom
PAD513  [SMD1,27-2,54]  64.77,5.08 0 bottom
PAD514  [SMD1,27-2,54]  57.15,2.54 0 bottom
PAD515  [SMD1,27-2,54]  59.69,2.54 0 bottom
PAD516  [SMD1,27-2,54]  62.23,2.54 0 bottom
PAD517  [SMD1,27-2,54]  64.77,2.54 0 bottom
PAD518  [SMD1,27-2,54]  58.42,5.08 0 bottom
PAD519  [SMD1,27-2,54]  60.96,5.08 0 bottom
PAD520  [SMD1,27-2,54]  63.5,5.08 0 bottom
PAD521  [SMD1,27-2,54]  58.42,2.54 0 bottom
PAD522  [SMD1,27-2,54]  60.96,2.54 0 bottom
PAD523  [SMD1,27-2,54]  63.5,2.54 0 bottom
PAD524  [SMD1,27-2,54]  55.88,7.62 0 top
PAD525  [SMD1,27-2,54]  26.67,10.16 0 bottom
PAD526  [SMD1,27-2,54]  72.39,10.16 0 bottom
PAD527  [SMD1,27-2,54]  54.61,2.54 0 top
PAD528  [SMD1,27-2,54]  22.86,15.24 0 bottom
PAD529  [SMD1,27-2,54]  55.88,5.08 0 top
PAD530  [SMD1,27-2,54]  73.66,12.7 0 bottom
PAD531  [SMD1,27-2,54]  76.2,10.16 0 bottom
PAD532  [SMD1,27-2,54]  22.86,12.7 0 bottom
PAD533  [SMD1,27-2,54]  25.4,12.7 0 bottom
PAD534  [SMD1,27-2,54]  74.93,12.7 0 bottom
PAD535  [SMD1,27-2,54]  76.2,12.7 0 bottom
PAD536  [SMD1,27-2,54]  24.13,12.7 0 bottom
PAD537  [SMD1,27-2,54]  25.4,10.16 0 bottom
PAD538  [SMD1,27-2,54]  53.34,7.62 0 top
PAD539  [SMD1,27-2,54]  76.2,15.24 0 bottom
PAD540  [SMD1,27-2,54]  24.13,15.24 0 bottom
PAD541  [SMD1,27-2,54]  73.66,10.16 0 bottom
PAD542  [SMD1,27-2,54]  55.88,2.54 0 top
PAD543  [SMD1,27-2,54]  53.34,5.08 0 top
PAD544  [SMD1,27-2,54]  22.86,10.16 0 bottom
PAD545  [SMD1,27-2,54]  24.13,10.16 0 bottom
PAD546  [SMD1,27-2,54]  54.61,7.62 0 top
PAD547  [SMD1,27-2,54]  53.34,2.54 0 top
PAD548  [SMD1,27-2,54]  29.21,7.62 0 top
PAD549  [SMD1,27-2,54]  31.75,7.62 0 top
PAD550  [SMD1,27-2,54]  34.29,7.62 0 top
PAD551  [SMD1,27-2,54]  36.83,7.62 0 top
PAD552  [SMD1,27-2,54]  27.94,7.62 0 top
PAD553  [SMD1,27-2,54]  30.48,7.62 0 top
PAD554  [SMD1,27-2,54]  33.02,7.62 0 top
PAD555  [SMD1,27-2,54]  35.56,7.62 0 top
PAD556  [SMD1,27-2,54]  29.21,5.08 0 top
PAD557  [SMD1,27-2,54]  31.75,5.08 0 top
PAD558  [SMD1,27-2,54]  34.29,5.08 0 top
PAD559  [SMD1,27-2,54]  36.83,5.08 0 top
PAD560  [SMD1,27-2,54]  27.94,5.08 0 top
PAD561  [SMD1,27-2,54]  30.48,5.08 0 top
PAD562  [SMD1,27-2,54]  33.02,5.08 0 top
PAD563  [SMD1,27-2,54]  35.56,5.08 0 top
PAD564  [SMD1,27-2,54]  29.21,2.54 0 top
PAD565  [SMD1,27-2,54]  31.75,2.54 0 top
PAD566  [SMD1,27-2,54]  34.29,2.54 0 top
PAD567  [SMD1,27-2,54]  36.83,2.54 0 top
PAD568  [SMD1,27-2,54]  27.94,2.54 0 top
PAD569  [SMD1,27-2,54]  30.48,2.54 0 top
PAD570  [SMD1,27-2,54]  33.02,2.54 0 top
PAD571  [SMD1,27-2,54]  35.56,2.54 0 top
PAD574  [SMD1,27-2,54]  58.42,7.62 0 top
PAD575  [SMD1,27-2,54]  60.96,7.62 0 top
PAD576  [SMD1,27-2,54]  63.5,7.62 0 top
PAD577  [SMD1,27-2,54]  66.04,7.62 0 top
PAD578  [SMD1,27-2,54]  68.58,7.62 0 top
PAD579  [SMD1,27-2,54]  71.12,7.62 0 top
PAD582  [SMD1,27-2,54]  58.42,5.08 0 top
PAD583  [SMD1,27-2,54]  60.96,5.08 0 top
PAD584  [SMD1,27-2,54]  63.5,5.08 0 top
PAD585  [SMD1,27-2,54]  66.04,5.08 0 top
PAD586  [SMD1,27-2,54]  68.58,5.08 0 top
PAD587  [SMD1,27-2,54]  71.12,5.08 0 top
PAD590  [SMD1,27-2,54]  58.42,2.54 0 top
PAD591  [SMD1,27-2,54]  60.96,2.54 0 top
PAD592  [SMD1,27-2,54]  63.5,2.54 0 top
PAD593  [SMD1,27-2,54]  66.04,2.54 0 top
PAD594  [SMD1,27-2,54]  68.58,2.54 0 top
PAD595  [SMD1,27-2,54]  71.12,2.54 0 top
PAD597  [SMD1,27-2,54]  57.15,7.62 0 top
PAD598  [SMD1,27-2,54]  59.69,7.62 0 top
PAD599  [SMD1,27-2,54]  62.23,7.62 0 top
PAD600  [SMD1,27-2,54]  64.77,7.62 0 top
PAD601  [SMD1,27-2,54]  67.31,7.62 0 top
PAD602  [SMD1,27-2,54]  69.85,7.62 0 top
PAD603  [SMD1,27-2,54]  72.39,7.62 0 top
PAD605  [SMD1,27-2,54]  57.15,5.08 0 top
PAD606  [SMD1,27-2,54]  59.69,5.08 0 top
PAD607  [SMD1,27-2,54]  62.23,5.08 0 top
PAD608  [SMD1,27-2,54]  64.77,5.08 0 top
PAD609  [SMD1,27-2,54]  67.31,5.08 0 top
PAD610  [SMD1,27-2,54]  69.85,5.08 0 top
PAD611  [SMD1,27-2,54]  76.2,15.24 0 top
PAD613  [SMD1,27-2,54]  57.15,2.54 0 top
PAD614  [SMD1,27-2,54]  59.69,2.54 0 top
PAD615  [SMD1,27-2,54]  62.23,2.54 0 top
PAD616  [SMD1,27-2,54]  64.77,2.54 0 top
PAD617  [SMD1,27-2,54]  67.31,2.54 0 top
PAD618  [SMD1,27-2,54]  69.85,2.54 0 top
PAD619  [SMD1,27-2,54]  72.39,2.54 0 top
PAD620  [SMD1,27-2,54]  22.86,12.7 0 top
PAD621  [SMD1,27-2,54]  25.4,12.7 0 top
PAD622  [SMD1,27-2,54]  24.13,12.7 0 top
PAD623  [SMD1,27-2,54]  72.39,10.16 0 top
PAD624  [SMD1,27-2,54]  73.66,10.16 0 top
PAD625  [SMD1,27-2,54]  76.2,10.16 0 top
PAD626  [SMD1,27-2,54]  74.93,12.7 0 top
PAD627  [SMD1,27-2,54]  26.67,7.62 0 top
PAD628  [SMD1,27-2,54]  22.86,10.16 0 top
PAD629  [SMD1,27-2,54]  25.4,10.16 0 top
PAD630  [SMD1,27-2,54]  24.13,15.24 0 top
PAD631  [SMD1,27-2,54]  22.86,15.24 0 top
PAD632  [SMD1,27-2,54]  74.93,10.16 0 top
PAD633  [SMD1,27-2,54]  73.66,12.7 0 top
PAD634  [SMD1,27-2,54]  76.2,12.7 0 top
PAD635  [SMD1,27-2,54]  26.67,2.54 0 top
PAD636  [SMD1,27-2,54]  26.67,10.16 0 top
PAD637  [SMD1,27-2,54]  24.13,10.16 0 top
QG1  SM77HL  [SM77HL]  64.14,27.3 270 bottom
R1  [R2012W]  57.15,22.23 0 bottom
R2  [R2012]  54.5,5 180 bottom
R3  [R2012]  54.5,7.6 180 bottom
R4  [R2012]  54.6,2.4 0 bottom
R5  [R2012]  33.7,34.6 180 bottom
R6  [R2012]  33.7,38.5 180 bottom
R7  [R2012]  33.7,43.4 0 bottom
R8  [R2012]  33.79,46.99 180 bottom
R9  [R2012]  33.99,54.51 0 bottom
SJ1  [SJ_2]  33.02,50.8 270 bottom

## Tracks (layer width: path | path; a pad name or v marks a point on that pad's centre or on a via)
3
  Top 0.16: IC1.3 41.7,26.99 33.47,18.76 30.87,18.76 29.27,17.16 29.27,15.18 JP1.3
4
  Top 0.16: IC1.4 42.2,26.99 33.47,18.26 32.23,18.26 JP1.4
5
  Top 0.16: IC1.5 42.7,26.99 33.47,17.76 32.57,17.76 31.77,16.96 31.77,15.22 JP1.5
6
  Top 0.16: IC1.6 43.2,26.69 JP1.6
7
  Top 0.16: IC1.7 43.7,26.49 34.37,17.16 34.37,15.16 JP1.7
8
  Top 0.16: IC1.8 44.2,25.15 JP1.8
9
  Top 0.16: IC1.9 44.7,24.99 36.87,17.16 36.87,15.2 JP1.9
10
  Top 0.16: IC1.10 45.2,23.61 JP1.10
13
  Top 0.16: IC1.13 46.7,22.19 41.97,17.46 41.97,15.18 JP1.13
14
  Top 0.16: IC1.14 47.2,20.53 JP1.14
19
  Top 0.16: IC1.19 49.7,17.39 49.47,17.16 49.47,15.3 JP1.19
21
  Top 0.16: IC1.21 50.7,18.53 52.07,17.16 52.07,15.24 JP1.21
23
  Top 0.16: IC1.23 51.7,20.03 54.57,17.16 54.57,15.28 JP1.23
24
  Top 0.16: IC1.24 52.2,20.19 JP1.24
25  (via drill 0.31)
  Top 0.16: IC1.25 52.67,29.46 52.67,26.16 v52.77,26.06 52.87,25.86 52.87,20.96 57.17,16.76 57.17,15.22 JP1.25
  Bottom 0.16: v52.77,26.06 56.21,22.52 R1.2
26
  Top 0.16: IC1.26 53.2,26.73 53.57,26.36 53.57,21.36 JP1.26
27
  Top 0.16: JP1.27 59.57,15.36 59.57,17.26 54.07,22.76 54.07,26.46 53.7,26.83 IC1.27
28
  Top 0.16: IC1.28 54.2,26.93 54.57,26.56 54.57,22.9 JP1.28
31
  Top 0.16: IC1.31 55.7,23.53 61.57,17.66 64.17,17.66 64.87,16.96 64.87,15.14 JP1.31
32
  Top 0.16: IC1.32 56.2,24.13 62.27,18.06 64.49,18.06 JP1.32
33
  Top 0.16: IC1.33 56.7,24.43 62.57,18.56 64.77,18.56 65.37,17.96 66.77,17.96 67.37,17.36 67.37,15.18 JP1.33
39
  Top 0.16: IC1.39 63.34,32.89 71.17,25.06 71.17,23.46 72.37,22.26 72.37,20.96 73.07,20.26 74.87,20.26 JP2.3
40
  Top 0.16: IC1.40 63.34,33.39 71.77,24.96 71.77,23.48 JP2.4
41
  Top 0.16: IC1.41 63.34,33.89 72.27,24.96 72.27,23.66 73.07,22.86 74.93,22.86 JP2.5
42
  Top 0.16: IC1.42 63.4,34.39 JP2.6
44
  Top 0.16: IC1.44 64.94,35.39 JP2.8
46
  Top 0.16: IC1.46 66.48,36.39 JP2.10
47
  Top 0.16: IC1.47 66.74,36.89 72.97,30.66 75.11,30.66 JP2.11
48
  Top 0.16: IC1.48 68.02,37.39 JP2.12
49
  Top 0.16: IC1.49 68.14,37.89 72.87,33.16 75.07,33.16 JP2.13
50
  Top 0.16: IC1.50 69.56,38.39 JP2.14
51
  Top 0.16: IC1.51 69.74,38.89 72.97,35.66 75.03,35.66 JP2.15
52
  Top 0.16: IC1.52 71.1,39.39 JP2.16
53
  Top 0.16: IC1.53 71.24,39.89 72.97,38.16 74.99,38.16 JP2.17
54
  Top 0.16: IC1.54 72.64,40.39 JP2.18
55
  Top 0.16: IC1.55 72.84,40.89 73.17,40.56 74.85,40.56 JP2.19
59
  Top 0.16: IC1.59 70.2,42.89 72.97,45.66 74.87,45.66 JP2.23
60
  Top 0.16: IC1.60 70.06,43.39 JP2.24
61
  Top 0.16: IC1.61 68.7,43.89 73.07,48.26 74.93,48.26 JP2.25
62
  Top 0.16: IC1.62 68.52,44.39 JP2.26
63
  Top 0.16: IC1.63 67.1,44.89 72.97,50.76 74.89,50.76 JP2.27
65
  Top 0.16: IC1.65 65.5,45.89 72.87,53.26 74.85,53.26 JP2.29
67
  Top 0.16: IC1.67 65.8,46.89 72.47,53.56 72.47,55.26 73.07,55.86 74.91,55.86 JP2.31
68
  Top 0.16: IC1.68 65.7,47.39 71.97,53.66 71.97,55.46 JP2.32
69
  Top 0.16: IC1.69 65.6,47.89 71.57,53.86 71.57,55.86 72.37,56.66 72.37,57.76 72.97,58.36 74.87,58.36 JP2.33
70
  Top 0.16: IC1.70 63.6,48.39 71.97,56.76 71.97,58 JP2.34
74
  Top 0.16: IC1.74 57.7,53.99 65.67,61.96 68.47,61.96 71.12,64.61 JP3.2
75
  Top 0.16: IC1.75 57.2,54.09 65.57,62.46 68.27,62.46 69.87,64.06 69.87,66.02 JP3.3
76
  Top 0.16: IC1.76 56.7,54.19 65.57,63.06 66.87,63.06 JP3.4
77
  Top 0.16: IC1.77 56.2,54.29 65.47,63.56 66.77,63.56 67.27,64.06 67.27,66.08 JP3.5
78
  Top 0.16: IC1.78 55.7,54.43 JP3.6
79
  Top 0.16: IC1.79 55.2,54.59 64.67,64.06 64.67,66.14 JP3.7
80
  Top 0.16: IC1.80 54.7,56.59 62.17,64.06 62.79,64.06 JP3.8
81
  Top 0.16: IC1.81 54.2,58.59 59.67,64.06 59.67,66.02 JP3.9
84
  Top 0.16: IC1.84 52.7,60.39 55.37,63.06 56.71,63.06 JP3.12
85
  Top 0.16: IC1.85 52.2,60.49 55.27,63.56 56.57,63.56 57.17,64.16 57.17,66.02 JP3.13
86
  Top 0.16: IC1.86 51.7,60.59 JP3.14
87
  Top 0.16: IC1.87 51.2,60.69 54.47,63.96 54.47,66.18 JP3.15
88
  Top 0.16: IC1.88 50.7,62.13 JP3.16
89
  Top 0.16: IC1.89 50.2,62.29 51.97,64.06 51.97,66.14 JP3.17
90
  Top 0.16: IC1.90 49.7,63.67 JP3.18
91
  Top 0.16: IC1.91 49.2,63.79 49.57,64.16 49.57,66 JP3.19
92
  Top 0.16: IC1.92 48.7,64.33 JP3.20
94
  Top 0.16: IC1.94 47.7,62.79 JP3.22
95
  Top 0.16: IC1.95 47.2,61.43 44.57,64.06 44.57,65.92 JP3.23
97
  Top 0.16: IC1.97 46.2,59.83 42.07,63.96 42.07,65.88 JP3.25
98
  Top 0.16: IC1.98 45.7,59.71 JP3.26
99
  Top 0.16: IC1.99 45.2,58.33 39.57,63.96 39.57,65.84 JP3.27
100
  Top 0.16: IC1.100 44.7,58.17 JP3.28
101
  Top 0.16: IC1.101 44.2,58.03 38.67,63.56 37.47,63.56 36.87,64.16 36.87,66 JP3.29
103
  Top 0.16: IC1.103 43.2,58.53 38.67,63.06 36.87,63.06 36.37,63.56 34.97,63.56 34.27,64.26 34.27,66.06 JP3.31
105
  Top 0.16: IC1.105 42.2,59.03 38.57,62.66 36.67,62.66 36.17,63.16 34.27,63.16 33.87,63.56 32.37,63.56 31.77,64.16 31.77,66.02 JP3.33
106
  Top 0.16: IC1.106 41.7,58.93 38.37,62.26 36.47,62.26 35.97,62.76 34.17,62.76 33.77,63.06 32.09,63.06 JP3.34
112
  Top 0.16: IC1.112 35.04,47.89 28.27,54.66 28.27,55.76 27.27,56.76 27.27,57.82 JP4.4
113
  Top 0.16: IC1.113 34.84,47.39 27.67,54.56 27.67,55.56 26.77,56.46 26.77,57.76 26.07,58.46 24.17,58.46 JP4.5
114
  Top 0.16: IC1.114 34.64,46.89 27.17,54.36 27.17,55.36 26.77,55.76 26.77,55.78 JP4.6
115
  Top 0.16: IC1.115 34.44,46.39 26.67,54.16 26.67,55.26 26.07,55.86 24.11,55.86 JP4.7
116
  Top 0.16: IC1.116 34.12,45.89 JP4.8
117
  Top 0.16: IC1.117 31.34,45.39 25.97,50.76 24.17,50.76 JP4.9
120  (via drill 0.31)
  Top 0.16: IC1.120 32.61,43.89 32.1,44.4 | 32.1,44.4 30.53,44.4 JP4.12 | v32.6,44.8 32.5,44.8 32.1,44.4
  Bottom 0.16: SJ1.2 32.4,50.8 31.5,49.9 31.5,45.9 v32.6,44.8
122  (via drill 0.31)
  Top 0.16: IC1.122 31.7,42.89 | 31.7,42.89 29.5,42.89 JP4.14 | v31.8,43.4 31.8,42.99 31.7,42.89
  Bottom 0.16: R7.2 v31.8,43.4
123
  Top 0.16: IC1.123 29.34,42.39 26.07,45.66 24.07,45.66 JP4.15
124
  Top 0.16: IC1.124 27.96,41.89 JP4.16
125
  Top 0.16: IC1.125 27.84,41.39 26.17,43.06 24.01,43.06 JP4.17
126
  Top 0.16: IC1.126 26.42,40.89 JP4.18
127
  Top 0.16: IC1.127 26.24,40.39 25.97,40.66 24.15,40.66 JP4.19
128
  Top 0.16: IC1.128 25.92,39.89 JP4.20
129
  Top 0.16: IC1.129 27.4,39.39 26.07,38.06 24.09,38.06 JP4.21
130
  Top 0.16: IC1.130 27.46,38.89 JP4.22
131  (via drill 0.31)
  Top 0.16: IC1.131 36.8,38.39 | 36.8,38.39 28.9,38.39 26.07,35.56 24.13,35.56 JP4.23 | v35.7,37.8 36.31,37.8 36.8,38.39
  Bottom 0.16: R6.2 34.9,38.5 v35.7,37.8
134
  Top 0.16: IC1.134 30.54,36.89 JP4.26
135  (via drill 0.31)
  Top 0.16: IC1.135 32.6,36.39 | 32.6,36.39 31.9,36.39 26.07,30.56 24.21,30.56 JP4.27 | v32.4,35.9 32.4,36.09 32.6,36.39
  Bottom 0.16: R5.2 34.55,35.15 34,35.7 32.6,35.7 v32.4,35.9
137
  Top 0.16: IC1.137 33.5,35.39 26.17,28.06 24.25,28.06 JP4.29
138
  Top 0.16: IC1.138 33.62,34.89 JP4.30
139
  Top 0.16: IC1.139 33.8,34.39 26.67,27.26 26.67,26.06 26.07,25.46 24.19,25.46 JP4.31
140
  Top 0.16: IC1.140 33.9,33.89 27.27,27.26 27.27,26 JP4.32
141
  Top 0.16: IC1.141 34.1,33.39 27.77,27.06 27.77,25.66 26.67,24.56 26.67,23.46 26.07,22.86 24.13,22.86 JP4.33
GND  (via drill 0.31)  (1 unrouted)
  Top 0.28: 62.54,46.4 IC1.66 58.74,46.4 | IC1.57 62.63,41.89 arc90 62.64,41.9 | IC1.45 62.43,35.89 arc90 62.44,35.9 | IC1.38 62.33,32.39 arc90 62.34,32.4 | IC1.20 50.2,27.54 arc90 50.24,27.5 | IC1.11 45.7,27.86 arc-90 45.64,27.8 | IC1.30 55.2,30.86 55.44,31.1
  Top 0.305: 60.5,41.9 57.9,41.9
  Top 1.016: 49.4,42.6 49.4,43.9 | 51.5,40.5 52.5,40.5 | 49.6,38.7 49.6,37.4 | 47.5,40.5 46.4,40.5
  Bottom 0.28: C15.2 42.34,46.5 v42.74,46.1
  Bottom 1.016: 49.4,42.5 49.4,43.9 | 51.3,40.5 52.5,40.5 | 49.5,38.8 49.5,37.4 | 47.5,40.5 46.4,40.5
  other vias: 66.34,49.5 40.84,57.2 63.24,51.5 35.54,51.6 43.14,44.2 43.24,42.4 43.34,39 43.34,36.5 47.14,34.4 50.34,34.4 53.84,34.6 55.64,36 55.64,43.3 55.64,40.5 55.84,45.7 58.54,48.3 46.64,21.3 39.64,21.4 31.94,29.4 39.44,28.3 44.54,46.9 49.04,46.9 53.34,53.6 53.44,55.1 57.74,63.1 52.14,18.43 66.14,45.6 72.24,50.9 56.04,56.6 59.44,60 65.84,32.8 61.94,28.6 42.83,9.87 46.99,5.08 46.99,11.43
  pour Top: 21.59,63.58 21.59,5 arc90 26.59,0 72.47,0 arc90 77.47,5 77.47,63.58 arc90 72.47,68.58 26.59,68.58 arc90
  pour Bottom: 21.59,63.58 21.59,5 arc90 26.59,0 72.47,0 arc90 77.47,5 77.47,63.58 arc90 72.47,68.58 26.59,68.58 arc90
N$1
  Bottom 0.305: R1.1 59.78,22.22 QG1.3
N$2  (via drill 3.2)
  other vias: 5,5
N$3  (via drill 3.2)
  other vias: 95,5
N$4  (via drill 3.2)
  other vias: 95,75
N$5  (via drill 3.2)
  other vias: 5,75
N$6  (via drill 3.2)
  other vias: 24,5
N$7  (via drill 3.2)
  other vias: 75,5
N$8  (via drill 3.2)
  other vias: 75,75
N$9  (via drill 3.2)
  other vias: 24,75
N$10
  Bottom 0.3: SJ1.1 33.02,53.89 R9.2
N$12
  Bottom 0.3: SJ1.3 33.02,47.41 R8.1
TCK
  Top 0.16: IC1.16 48.2,18.99 JP1.16
  Bottom 0.16: JP1.16 44.45,15.24 44.45,5.71 43.81,5.08 41.91,5.08 JP5.1 40.64,3.06 41.8,1.9 53.25,1.9 R4.2
TDI
  Top 0.16: IC1.17 48.7,18.86 46.99,17.14 46.99,15.24 JP1.17
  Bottom 0.16: JP5.9 52.07,5.08 52.07,8 | 52.07,8 52.07,10.16 JP1.17 | R3.1 53.25,8 52.07,8
TDO
  Top 0.16: IC1.18 49.2,17.45 JP1.18 48.26,15.88 49.53,14.61 49.53,3.17 48.9,2.54 44.45,2.54 JP5.3
TMS
  Top 0.16: IC1.15 47.7,20.39 44.45,17.14 44.45,15.24 JP1.15 44.45,12.7 44.45,5.08 JP5.5
  Bottom 0.16: R2.1 52.3,3.65 52.3,3.2 51.6,2.5 47,2.5 45.72,3.78 JP5.5
VCC  (via drill 0.31)
  Top 0.152: 38.84,29.39 38.84,29.6 C22.1
  Top 0.28: IC1.73 59.95,51.89 C7.1 | 60.7,51.23 IC1.72 | 38.9,51.89 IC1.108 | 38.2,51.2 IC1.109 | 60.7,30.36 IC1.37 | 59.73,29.39 IC1.36 | IC1.1 38.84,29.39 38.48,29.39 | 38.2,30.12 IC1.144 39.74,31.9 39.94,32.1 39.94,32.7 39.75,32.89 IC1.142 | 39.83,37.89 IC1.132 | IC1.58 | IC1.118
  Top 0.3: IC1.12 46.2,31.16 v46.24,31.2 | IC1.22 51.2,30.86 v51.24,31.2 | IC1.29 54.7,31.26 v54.74,31.3 | v58.74,35 58.85,34.89 IC1.43 | v58.74,41.2 58.95,41.39 IC1.56 | v58.74,45.4 v58.75,45.39 IC1.64 | IC1.82 53.7,50.1 v53.64,50 | v48.14,50 48.2,50.06 IC1.93 | IC1.102 43.7,50.14 v43.74,50 | v40.14,35.5 39.74,35.9 IC1.136 | 39.83,37.89 v40.14,38.1 | IC1.121 39.95,43.39 v40.14,43.2 | v40.14,45.3 39.74,44.9 IC1.118 | v40.14,48.7 39.84,48.4 IC1.111 | 38.2,30.12 C22.1 | 59.73,29.39 C1.1 60.7,30.36 | 60.15,51.89 C7.1 60.7,51.23 | 38.2,51.2 C13.1 38.9,51.89 | 58.24,29.34 IC1.36
  Top 0.305: IC1.58 58.75,42.39 v58.54,42.6
  Top 0.6: v39.34,50.8 39.33,50.8 C13.1 | v58.84,50 59.44,50.6 C7.1 | v59.34,30.7 C1.1 | C22.1 38.73,29.84 40.56,31.68 40.56,32.92 v40.64,33
  Bottom 0.152: 25.47,29.26 JP4.28 | 25.47,34.36 JP4.24 | JP3.1 71.17,67.36 71.17,67.26
  Bottom 0.16: JP1.12 41.91,15.24 41.91,7.62 JP5.4
  Bottom 0.28: C15.1 40.44,47.61 40.44,46.3 41.34,45.4 42.94,45.4 44.16,44.18 44.42,44.58 | 43.64,43.4 44.32,43.4 44.28,43.96 | 44.28,43.96 44.42,44.6 | 40.41,42.02 40.41,41.83 40.84,41.4 43.92,41.4 44.42,41.8 | C18.1 40.41,39.08 41.44,40.1 44.42,40.1 | C19.1 40.5,36.46 41.44,37.4 43.92,37.4 44.42,37.1 | 44.34,44.1 44.28,43.96 | 52.06,49.83 51.74,49.5 51.74,47.2 54.24,44.7 54.83,44.7 | 48.24,32.5 48.24,34.5 49.47,35.73 50.44,35.73 | 49.24,32.4 49.24,34.3 50.67,35.73 51.34,35.73
  Bottom 0.3: v46.24,31.2 46.84,31.18 C24.1 | v51.24,31.2 51.32,31.3 C25.1 | v54.74,31.3 54.74,31.5 C26.1 | C3.1 58.38,35.35 v58.74,35 | C5.1 58.42,43.42 58.32,42.92 v58.54,42.6 | C4.1 58.6,41.06 v58.74,41.2 | v58.74,45.4 58.56,45.6 C6.1 58.48,46.35 | v53.64,50 53.44,49.83 C9.1 52.16,49.83 | C10.1 48.41,49.83 v48.14,50 48.64,50 48.94,49.7 49.34,49.7 | v43.74,50 43.91,49.83 C11.1 45.22,49.83 46.04,49 | C19.1 40.15,36.01 v40.14,35.5 | v40.14,38.1 40.14,38.73 C18.1 | v40.14,43.2 40.14,42.76 C17.1 40.41,42.02 | v40.14,45.3 40.12,44.52 C16.1 40.31,44.12 41.04,43.4 43.64,43.4 | 52.34,35.36 53.27,35.73 | C15.1 40.58,48.26 v40.14,48.7 | R2.2 R3.2 55.35,9.05 54.6,9.8 54.6,15.25 JP1.22 | 30.48,34.29 30.79,34.6 R5.1 | R6.1 32.75,38.6 30.48,38.6 | R7.1 34.55,42.75 33.8,42 30.58,42 30.48,41.9 | R9.1 35.34,56.06 33.63,57.77
  Bottom 0.305: C24.1 47.24,31.5 48.24,32.5 | C25.1 50.13,31.5 49.24,32.4 | C26.1 53.23,31.5 52.34,32.4 52.34,35.36 52.44,35.46 | C3.1 58.59,36.55 57.74,37.4 54.64,37.4 54.59,37.45 | 54.59,37.45 54.44,36.9 | C4.1 58.59,39.84 57.94,39.2 56.34,39.2 54.59,37.45 | 58.42,43.42 58.42,44.02 58.04,44.4 54.94,44.4 54.83,44.7 54.44,45.7 | 58.48,46.35 58.48,46.95 57.14,48.3 | 52.16,49.83 52.06,49.83 | 49.34,49.7 49.64,49.7 50.34,49 50.34,46.8 48.14,44.6 44.7,44.6 44.38,45.42 | 44.38,45.42 44.22,45.82 | 46.04,49 46.04,46.92 44.54,45.42 44.38,45.42
  Bottom 0.406: C31.1 35.91,26.96 36.52,27.62 | C20.1 62.78,31.41 QG1.4 62.78,31.4 62.8,31.4 62.8,33 63.4,33.6 68.58,33.6 | v58.54,42.6 58.5,42.6
  Bottom 0.6: L1.2 41.44,25.6 C14.1 39.84,26 39.74,25.9 38.34,25.9 37.02,27.23 37.02,28.12 | 44.42,44.58 44.22,44.8 44.22,45.82 v39.34,50.8 | 54.44,45.7 54.84,46 57.14,48.3 v58.84,50 | 54.24,36.7 54.24,35.4 v59.34,30.7 | v40.64,33 41.34,33 41.62,32.73 | JP2.7 74.93,25.4 68.58,25.4 | JP1.29 62.23,15.24 62.23,20.32 | JP4.13 24.13,48.26 30.48,48.26 | JP3.21 46.99,66.04 46.99,58.42
  Bottom 1.016: 44.82,35.73 41.62,32.73 37.02,28.12 36.52,27.62 30.48,21.59 | 44.42,44.6 44.42,44.58 44.42,41.8 44.42,40.1 44.42,37.1 44.42,36.13 44.82,35.73 | 44.82,35.73 50.44,35.73 51.34,35.73 53.27,35.73 54.24,36.7 54.44,36.9 54.44,45.7 | 30.48,20.32 29.21,17.78 JP1.2 JP1.1 | JP1.12 40.64,20.32 | 40.64,20.32 30.48,20.32 | JP1.36 73.66,16.51 JP2.1 | JP1.35 JP1.36 | JP1.36 JP1.34 68.58,17.78 66.04,20.32 | 66.04,20.32 62.23,20.32 53.34,20.32 | 53.34,20.32 40.64,20.32 | JP2.35 JP2.36 | JP2.36 71.12,62.23 68.58,59.69 68.58,52.07 | 68.58,52.07 68.58,44.45 | 68.58,44.45 68.58,41.91 | 68.58,41.91 68.58,33.6 68.58,25.4 68.58,22.86 66.04,20.32 | JP3.36 34.29,58.42 | 30.48,52.07 30.48,48.26 30.48,41.9 30.48,38.6 30.48,34.29 | 30.48,34.29 30.48,29.21 | 30.48,29.21 30.48,22.86 | 30.48,22.86 30.48,21.59 | 30.48,21.59 30.48,20.32 | 34.29,58.42 35.56,58.42 | 35.56,58.42 46.99,58.42 54.61,58.42 JP3.10 | JP3.36 JP3.35 | JP3.36 25.4,64.77 JP4.1 JP4.3 | JP4.10 30.48,52.07 | JP3.30 35.56,58.42 | JP2.28 68.58,52.07 | JP2.20 68.58,41.91 | JP2.22 68.58,44.45 | JP1.22 53.34,20.32 | JP4.36 26.67,20.32 30.48,20.32 | JP4.34 26.67,22.86 30.48,22.86 | 30.48,52.07 30.48,54.61 33.63,57.77 34.29,58.42 | 25.47,34.36 30.41,34.36 30.48,34.29 | 25.47,29.26 30.43,29.26 30.48,29.21 | 71.17,67.26 73.66,64.77 JP2.36
VCCA  (via drill 0.31)
  Top 0.28: IC1.34 57.2,27.04 v57.44,26.8 | IC1.35 57.7,27.94 v58.34,27.3 | IC1.71 62.13,48.89 v62.54,49.3 | IC1.107 41.2,53.34 v40.94,53.6
  Top 0.3: v40.74,27.5 41.2,27.96 IC1.2
  Bottom 0.28: v57.44,26.8 57.44,26.77 C27.1 57.24,26.2 56.44,26.2 55.34,27.3 | v58.34,27.3 58.8,26.75 C28.1 58.84,26.2 59.14,25.9 59.34,25.9 59.84,26.4 59.84,27 58.44,28.4 | v62.54,49.3 63.3,49.3 C2.1 63.44,49.4 | C8.1 47.54,25.6 | 62.84,47.3 62.84,48.8 63.44,49.4 | 63.44,49.4 63.54,49.4 | v40.94,53.6 40.94,54.17 C12.1 | C23.2 42.06,27.18 42.84,26.4 45.04,26.4 46.04,27.4 49.14,27.4 49.24,27.3
  Bottom 0.3: C23.2 40.91,27.33 v40.74,27.5
  Bottom 0.406: 47.54,25.6 49.24,27.3 55.34,27.3 56.64,27.3 57.74,28.4 58.44,28.4 58.88,28.4 60.2,29.72 60.2,32.1 62.84,34.74 62.84,47.3 55.87,54.27 C12.1
  Bottom 0.6: L1.1 45.24,25.6 C8.1

## Text on the board
Bottom: Akirahitoshi@201511
tNames: P105 | P103 | P101 | 3V3 | P99 | P97 | P95 | 3V3 | C3n | P91 | C2n | P89 | P87 | P85 | GND | P81 | P79 | P77 | P75 | 3V3 | 3V3 | P106 | GND | 3V3 | P100 | P98 | GND | P94 | P92 | C3p | P90 | C2p | P88 | P86 | P84 | 3V3 | P80 | P78 | P76 | P74 | 3V3 | 3V3 | GND | 3V3 | P70 | P69 | 3V3 | P112 | P68 | P67 | P113 | P114 | GND | P65 | P115 | P116 | 3V3 | P63 | P117 | 3V3 | P62 | P61 | GND | P120 | P60 | P59 | 3V3 | P122 | 3V3 | GND | P123 | P124 | 3V3 | P55 | P125 | P126 | P54 | P53 | P127 | P128 | P52 | P51 | P129 | P130 | P50 | P49 | P131 | 3V3 | P48 | P47 | GND | P134 | 10M02SCE144 | GND | P135 | 3V3 | P46 | P44 | 3V3 | P137 | P138 | P41 | P42 | P139 | P140 | P40 | P39 | P141 | 3V3 | GND | 3V3 | 3V3 | GND | 3V3 | 3V3 | P4 | P6 | P8 | P10 | 3V3 | P14 | TCK | TDO | GND | 3V3 | P24 | P26 | C0p | P28 | C1p | GND | P32 | 3V3 | P3 | P5 | P7 | P9 | 3V3 | GND | P13 | TMS | TDI | P19 | P21 | P23 | P25 | C0n | P27 | C1n | 3V3 | P31 | P33 | 3V3 | GND | 3V3 | NC | NC | GND | 10M02SCE144 BrakeOutBoard | TCK | TDO | TMS | NC | TDI
bNames: 3V3 | P105 | P103 | P101 | P99 | P97 | P95 | 3V3 | C3n | P91 | C2n | P89 | P87 | P85 | GND | P81 | P79 | P77 | P75 | 3V3 | 3V3 | 3V3 | P74 | 3V3 | 3V3 | GND | P106 | GND | 3V3 | P100 | P98 | GND | P94 | P92 | C3p | P90 | C2p | P88 | P86 | P84 | 3V3 | P80 | P78 | P76 | P70 | P69 | 3V3 | P112 | P68 | P67 | P113 | P114 | GND | P65 | P115 | P116 | 3V3 | P63 | P117 | 3V3 | P62 | P61 | GND | P120 | P60 | P59 | 3V3 | P122 | 3V3 | GND | P123 | P124 | 3V3 | P55 | P125 | P126 | P54 | P53 | P127 | P128 | P52 | P51 | P129 | P130 | P50 | P49 | P131 | 3V3 | P48 | P47 | GND | P134 | GND | P135 | 3V3 | P46 | P44 | 3V3 | P137 | P138 | P41 | P42 | P139 | P140 | P40 | P39 | P141 | 3V3 | GND | 3V3 | 3V3 | P4 | P6 | P8 | P10 | 3V3 | P14 | TCK | TDO | GND | 3V3 | P24 | P26 | C0p | P28 | C1p | GND | P32 | 3V3 | 3V3 | GND | 3V3 | 3V3 | GND | P13 | TMS | TDI | P19 | P21 | P23 | P25 | C0n | P27 | C1n | 3V3 | P31 | P33 | 3V3 | P3 | P5 | P7 | P9